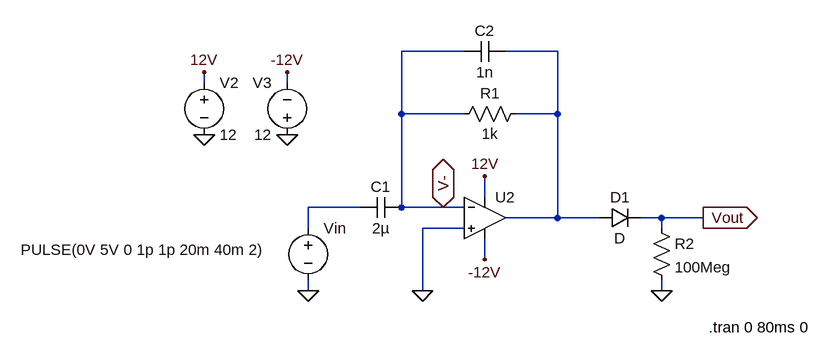
[diagram p0: schematic Differentiator_Pulse_Response.asc]
Differentiator_Pulse_Response.asc, the LTspice schematic file:
Version 4
SHEET 1 1048 680
WIRE 176 -32 80 -32
WIRE 320 -32 240 -32
WIRE -224 16 -224 0
WIRE -96 16 -96 0
WIRE 80 64 80 -32
WIRE 176 64 80 64
WIRE 320 64 320 -32
WIRE 320 64 256 64
WIRE 208 192 208 160
WIRE 16 208 -64 208
WIRE 80 208 80 64
WIRE 144 208 80 208
WIRE 176 208 144 208
WIRE 320 224 320 64
WIRE 320 224 240 224
WIRE 384 224 320 224
WIRE 480 224 448 224
WIRE 544 224 480 224
WIRE -64 240 -64 208
WIRE 176 240 112 240
WIRE 480 240 480 224
WIRE 208 288 208 256
WIRE -64 336 -64 320
WIRE 112 336 112 240
WIRE 480 336 480 320
FLAG 112 336 0
FLAG 208 160 12V
FLAG 208 288 -12V
FLAG -64 336 0
FLAG 544 224 Vout
IOPIN 544 224 Out
FLAG 144 208 V-
IOPIN 144 208 BiDir
FLAG -224 96 0
FLAG -96 96 0
FLAG -224 0 12V
FLAG -96 0 -12V
FLAG 480 336 0
SYMBOL res 272 48 R90
WINDOW 0 0 56 VBottom 2
WINDOW 3 31 56 VTop 2
SYMATTR InstName R1
SYMATTR Value 1k
SYMBOL cap 80 192 R90
WINDOW 0 0 32 VBottom 2
WINDOW 3 32 32 VTop 2
SYMATTR InstName C1
SYMATTR Value 2µ
SYMBOL voltage -64 224 R0
WINDOW 3 -442 49 Left 2
WINDOW 123 0 0 Left 0
WINDOW 39 0 0 Left 0
SYMATTR Value PULSE(0V 5V 0 1p 1p 20m 40m 2)
SYMATTR InstName Vin
SYMBOL voltage -224 0 R0
WINDOW 123 0 0 Left 0
WINDOW 39 0 0 Left 0
SYMATTR InstName V2
SYMATTR Value 12
SYMBOL voltage -96 112 R180
WINDOW 0 24 96 Left 2
WINDOW 3 24 16 Left 2
WINDOW 123 0 0 Left 0
WINDOW 39 0 0 Left 0
SYMATTR InstName V3
SYMATTR Value 12
SYMBOL OpAmps\\UniversalOpAmp2 208 224 R0
SYMATTR InstName U2
SYMATTR Value2 Avol=1Meg GBW=10G Slew=10G
SYMBOL cap 240 -48 R90
WINDOW 0 0 32 VBottom 2
WINDOW 3 32 32 VTop 2
SYMATTR InstName C2
SYMATTR Value 1n
SYMBOL diode 384 240 R270
WINDOW 0 32 32 VTop 2
WINDOW 3 0 32 VBottom 2
SYMATTR InstName D1
SYMBOL res 464 224 R0
SYMATTR InstName R2
SYMATTR Value 100Meg
TEXT 552 392 Left 2 !.tran 0 80ms 0

The netlist it stands for:
* Differentiator_Pulse_Response.asc
R1 N001 V- 1k
C1 V- N002 2µ
Vin N002 0 PULSE(0V 5V 0 1p 1p 20m 40m 2)
V2 12V 0 12
V3 0 -12V 12
XU2 0 V- 12V -12V N001 level2 Avol=1Meg GBW=10G Slew=10G Ilimit=25m Rail=0 Vos=0 En=0 Enk=0 In=0 Ink=0 Rin=500Meg  ; pins In+ In- V+ V- OUT
C2 N001 V- 1n
D1 N001 Vout D
R2 Vout 0 100Meg
.model D D
.lib standard.dio
.tran 0 80ms 0
.lib UniversalOpAmp2.lib
.backanno
.end